# Altium schematic sheet Sheet1.SchDoc
size A4
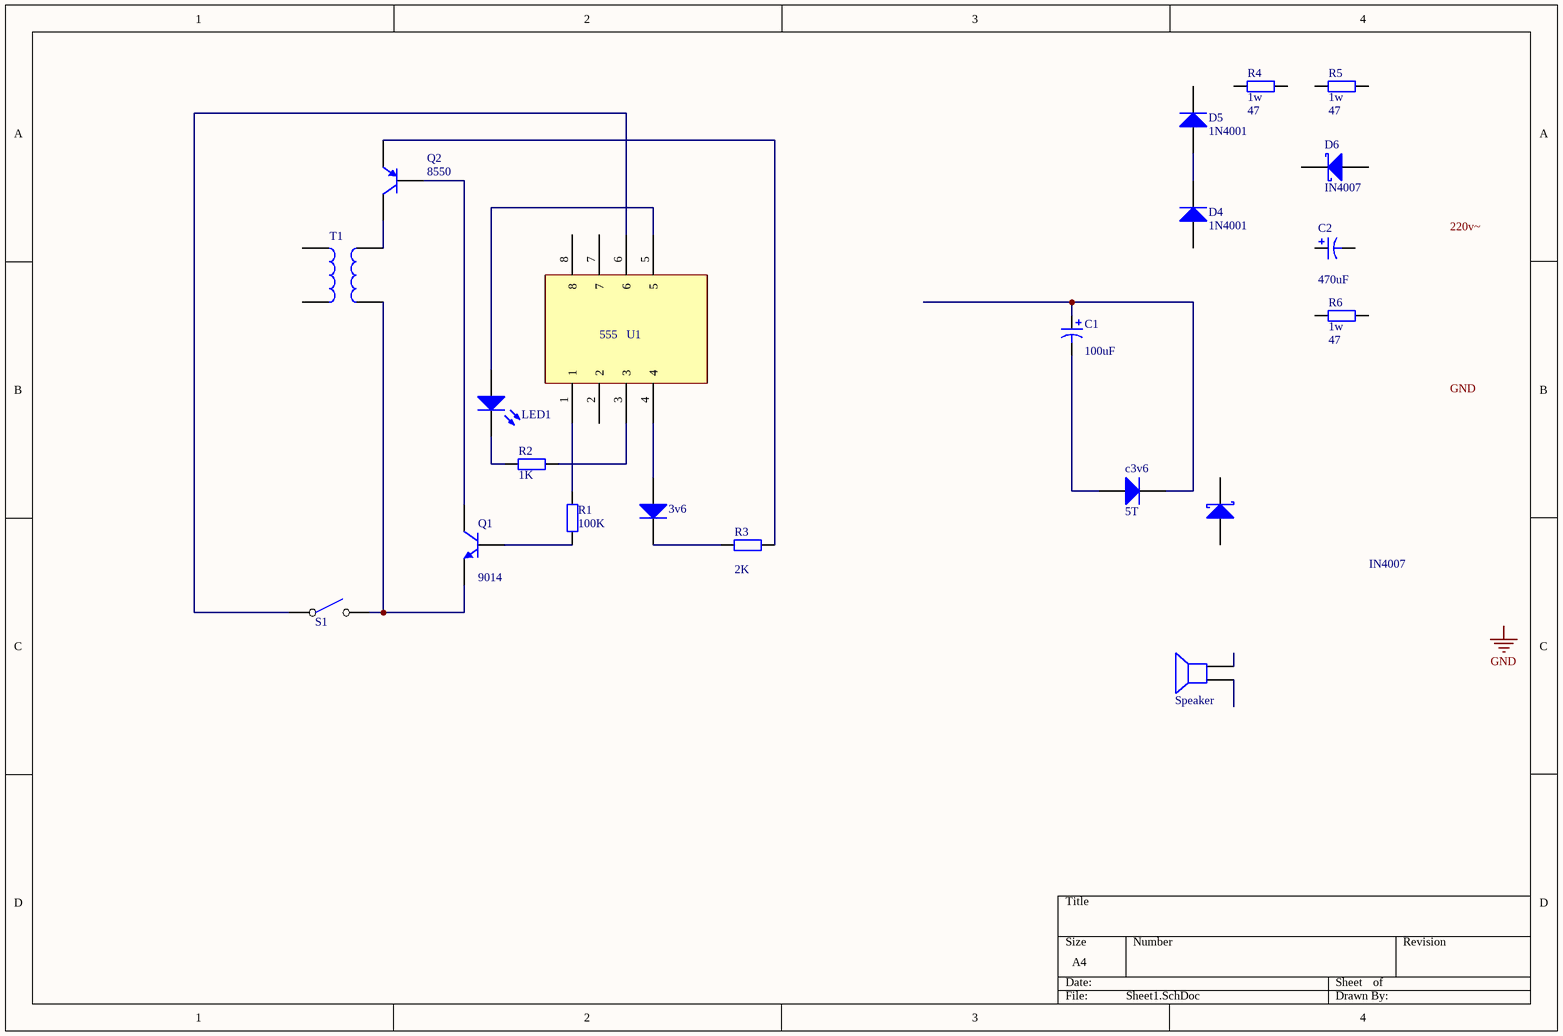
[diagram p0: Sheet1.SchDoc]

## Parts
3v6  1N4001  [DIO10.46-5.3x2.8]  (value not drawn)
C1  value 100uF  [CAPPR1.27-1.7x2.8]  (hidden comment: Cap Pol1)
C2  value 470uF  [CAPPR1.27-1.7x2.8]  (hidden comment: Cap Pol1)
c3v6  5T  [DIO10.46-5.3x2.8]
D1  IN4007  [SO-G3/C2.5]
D4  1N4001  [DIO10.46-5.3x2.8]
D5  1N4001  [DIO10.46-5.3x2.8]
D6  IN4007  [SO-G3/C2.5]
DS?  LED1  [LED-1]
LS?  Speaker  [PIN2]
Q1  9014  [BCY-W3]
Q2  8550  [BCY-W3/E4]
R1  value 100K  [AXIAL-0.4]  (hidden comment: Res2)
R2  value 1K  [AXIAL-0.4]  (hidden comment: Res2)
R3  value 2K  [AXIAL-0.4]  (hidden comment: Res2)
R4  1w  value 47  [AXIAL-0.4]
R5  1w  value 47  [AXIAL-0.4]
R6  1w  value 47  [AXIAL-0.4]
S?  S1
T1  Trans  [TRANS]  (value not drawn)
U1  555

## Nets
Net3v6_1: 3v6.1(A) U1.4
Net3v6_2: 3v6.2(K) R3.1
NetC1_1: C1.1 c3v6.2(K)
NetC1_2: C1.2 c3v6.1(A)
NetD4_2: D4.2(K) D5.1(A)
NetDS?_1: DS?.1(A) U1.5
NetDS?_2: DS?.2(K) R2.2
NetQ1_1: Q1.1(C) Q2.2(B)
NetQ1_2: Q1.2(B) R1.2
NetQ1_3: Q1.3(E) S?.2(NO) T1.4
NetQ2_1: Q2.1(E) R3.2
NetQ2_3: Q2.3(C) T1.3
NetR1_1: R1.1 U1.1
NetR2_1: R2.1 U1.3
NetS?_1: S?.1(COMMON) U1.6

Not connected (* = marked no-connect by the designer): C2 1 2; D1 1(A) 3(K); D4 1(A); D5 2(K); D6 1(A) 3(K); LS? 1 2; R4 1 2; R5 1 2; R6 1 2; T1 1 2; U1 2 7 8

## Notes on the sheet
- Labels drawn without touching a wire or pin: 220v~, GND

## Library data of the parts
3v6 c3v6 D4 D5 = Diode 1N4001: 1 Amp General Purpose Rectifier; Published: 8-Jun-2000; LatestRevisionDate: 17-Jul-2002; LatestRevisionNote: Re-released for DXP Platform.; DatasheetDocument: 1998; PackageDocument: Aug-1999; PackageReference: DO-41; Publisher: Altium Limited; Code_JEDEC: DO-204-AL
C1 C2 = Cap Pol1: Polarized Capacitor (Radial); Published: 8-Jun-2000; LatestRevisionDate: 17-Jul-2002; LatestRevisionNote: Re-released for DXP Platform.; Publisher: Altium Limited
D1 D6 = Diode BAS70: Silicon AF Schottky Diode for High-Speed Switching; Note: Pin 2 is not connected and not drawn.; Published: 21-Mar-2003; DatasheetDocument: Oct-1999; PackageDocument: Sep-2001; PackageReference: SOT-23; Publisher: Altium Limited
DS? = LED1: Typical RED GaAs LED; Published: 8-Jun-2000; LatestRevisionDate: 17-Jul-2002; LatestRevisionNote: Re-released for DXP Platform.; Publisher: Altium Limited
LS? = Speaker: Loudspeaker; Published: 24-Mar-1999; LatestRevisionDate: 17-Jul-2002; LatestRevisionNote: Re-released for DXP Platform.; Publisher: Altium Limited
Q1 = NPN: NPN Bipolar Transistor; Published: 8-Jun-2000; LatestRevisionDate: 17-Jul-2002; LatestRevisionNote: Re-released for DXP Platform.; Publisher: Altium Limited; Code_JEDEC: TO-226-AA
Q2 = 2N3906: PNP General Purpose Amplifier; Published: 8-Jun-2000; LatestRevisionDate: 15-Jan-2003; LatestRevisionNote: PCB Footprint 'BCY-W3/D4.7' replaced; DatasheetDocument: 1997; PackageReference: TO-92A; Publisher: Altium Limited; Code_JEDEC: TO-92A
R1-R6 = Res2: Resistor; Published: 8-Jun-2000; LatestRevisionDate: 17-Jul-2002; LatestRevisionNote: Re-released for DXP Platform.; Publisher: Altium Limited
S? = SW SPST
T1 = Trans: Transformer; Published: 24-Mar-1999; LatestRevisionDate: 17-Jul-2002; LatestRevisionNote: Re-released for DXP Platform.; Publisher: Altium Limited